# EAGLE design IO4SignalDriver-Small (EAGLE 7.7.0)

## Sheet 1 of 2
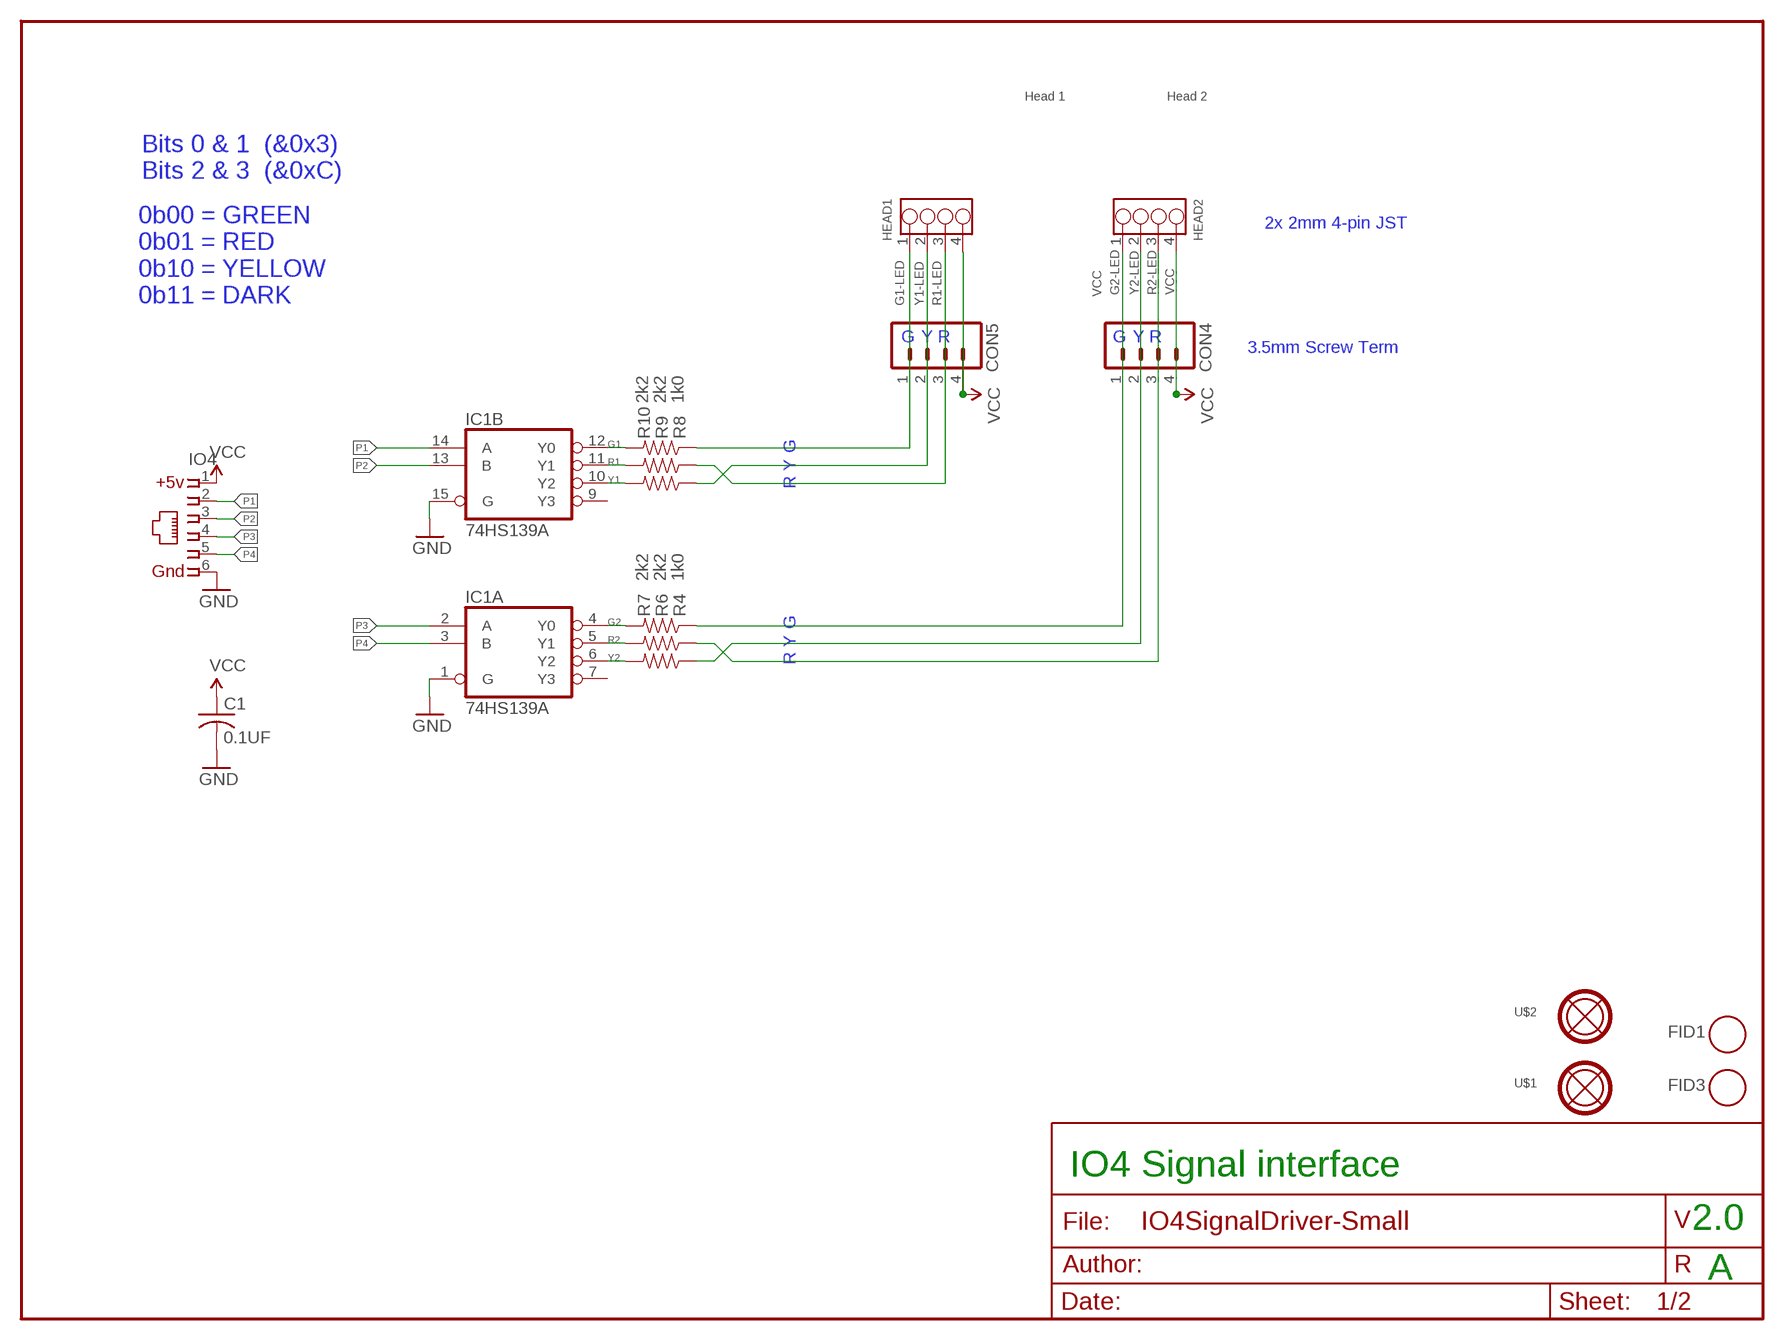
[diagram p0: schematic, sheet 1]

### Parts
C1  0.1UF  CAP0805  [0805-CAP]
CON4  CONNECTOR-M04SCREW  [SCREWTERMINAL-3.5MM-4]
CON5  CONNECTOR-M04SCREW  [SCREWTERMINAL-3.5MM-4]
FID1  FIDUCIAL  [FIDUCIAL_1MM]
FID3  FIDUCIAL  [FIDUCIAL_1MM]
HEAD1  Head 1  CONNECTOR-GROVE-4P-2.0-3470130P1  [4P-2.0]
HEAD2  Head 2  CONNECTOR-GROVE-4P-2.0-3470130P1  [4P-2.0]
IC1  74HS139A  74LS139D  [SO16]
IO4  CONNECTOR-IO4INV  [RJ25-INVERTED]
R4  1k0  R0805-RES  [0805-RES]
R6  2k2  R0805-RES  [0805-RES]
R7  2k2  R0805-RES  [0805-RES]
R8  1k0  R0805-RES  [0805-RES]
R9  2k2  R0805-RES  [0805-RES]
R10  2k2  R0805-RES  [0805-RES]
U$1  MOUNTINGHOLE  [MOUNTINGHOLE]
U$2  MOUNTINGHOLE  [MOUNTINGHOLE]

### Nets
G1: IC1.12(B:Y0) R10.2
G1-LED: CON5.1 HEAD1.1 R10.1
G2: IC1.4(A:Y0) R7.2
G2-LED: CON4.1 HEAD2.1 R7.1
GND [Power]: C1.2 IC1.1(A:G) IC1.15(B:G) IO4.6
P1 [signals]: IC1.14(B:A) IO4.2
P2 [signals]: IC1.13(B:B) IO4.3
P3 [signals]: IC1.2(A:A) IO4.4
P4 [signals]: IC1.3(A:B) IO4.5
R1: IC1.11(B:Y1) R9.2
R1-LED: CON5.3 HEAD1.3 R9.1
R2: IC1.5(A:Y1) R6.2
R2-LED: CON4.3 HEAD2.3 R6.1
VCC [Power]: C1.1 CON4.4 CON5.4 HEAD1.4 HEAD2.4 IO4.1
Y1: IC1.10(B:Y2) R8.2
Y1-LED: CON5.2 HEAD1.2 R8.1
Y2: IC1.6(A:Y2) R4.2
Y2-LED: CON4.2 HEAD2.2 R4.1
Unconnected: IC1.7(A:Y3) IC1.9(B:Y3)

### Notes on the sheet
- Bits 0 & 1  (&0x3)
  Bits 2 & 3  (&0xC)
- 2x 2mm 4-pin JST
- 0b00 = GREEN
  0b01 = RED
  0b10 = YELLOW
  0b11 = DARK
- G | Y | R | G | Y | R
- 3.5mm Screw Term
- G
- Y
- R
- G
- Y
- R
- IO4 Signal interface
- 2.0
- A

## Sheet 2 of 2
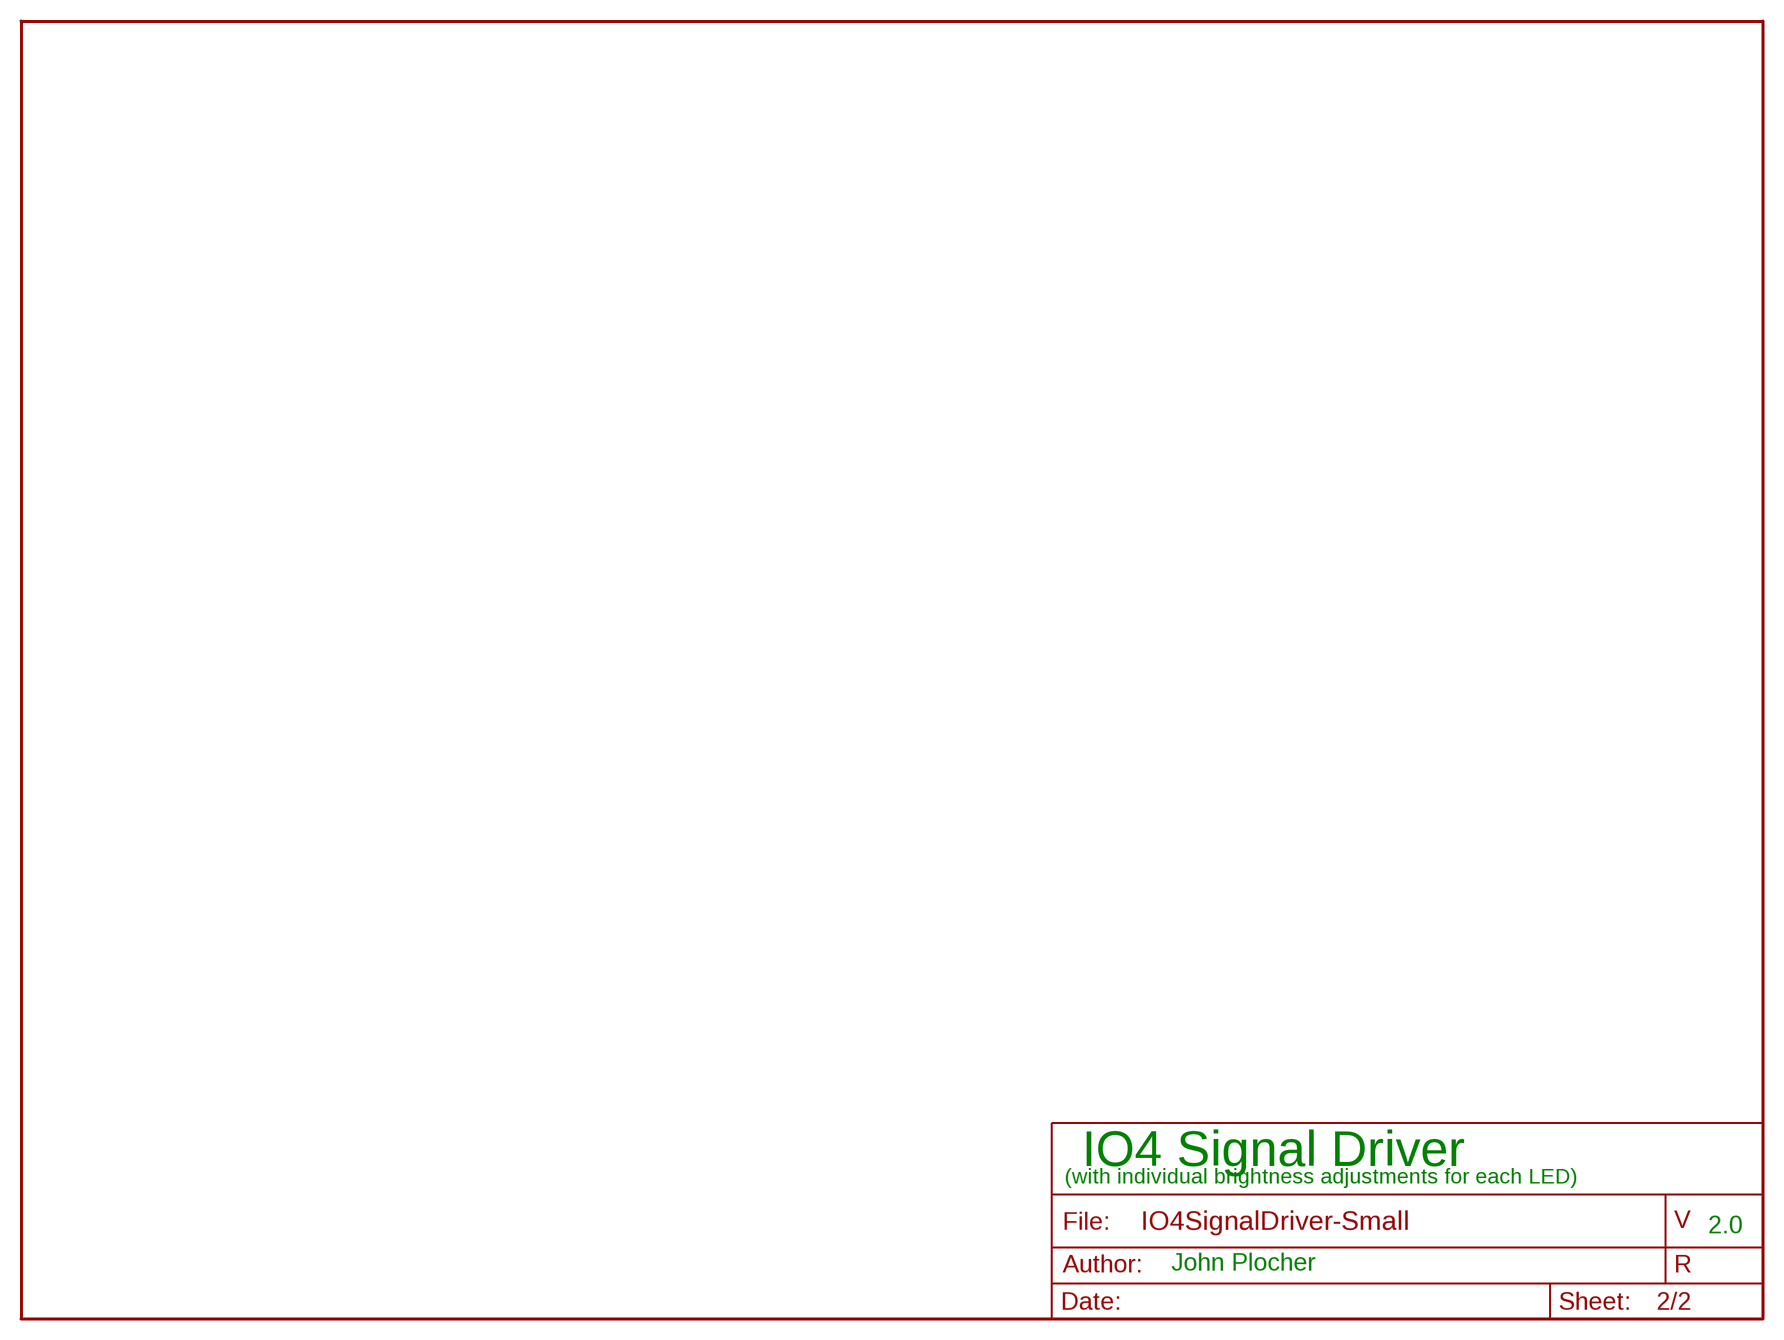
[diagram p1: schematic, sheet 2]

### Notes on the sheet
- IO4 Signal Driver
- (with individual brightness adjustments for each LED)
- 2.0
- John Plocher

## Power pins joined to a net without a drawn wire
GND: IC1.8(P:GND)
VCC: IC1.16(P:VCC)

## Library data of the parts
C1 = SPCoast:CAP*
CON4 CON5 = SPCoast:CONNECTOR-M04: Header 4 Standard 4-pin 0.1" header. Use with straight break away headers (SKU : PRT-00116), right angle break away headers (PRT-00553), swiss pins (PRT-00743), machine pins (PRT-00117), and female headers (PRT-00115). Molex polarized connector foot print use with SKU : PRT-08231 with associated crimp pins and housings. 1MM SMD Version SKU: PRT-10208
FID1 FID3 = SPCoast:FIDUCIAL: For use by pick and place machines to calibrate the vision/machine, 1mm By microbuilder.eu
HEAD1 HEAD2 = SPCoast:CONNECTOR-GROVE-4P-2.0
IC1 = SPCoast:74*139: Dual 2-line to 4-line DECODER/DEMULTIPLEXER
IO4 = SPCoast:CONNECTOR-IO4
R4 R6-R10 = SPCoast:R*: Resistor Basic schematic elements and footprints for 0603, 1206, and PTH 1/10th watt (small) resistors.
U$1 U$2 = SPCoast:MOUNTINGHOLE: Mounting hole with top and bottom copper and stop rings

## Net classes
0 default: width 0.254 mm, drill 0.5 mm
1 Power: width 0.254 mm, drill 0.6 mm
2 signals: width 0.254 mm, drill 0.5 mm

## Board
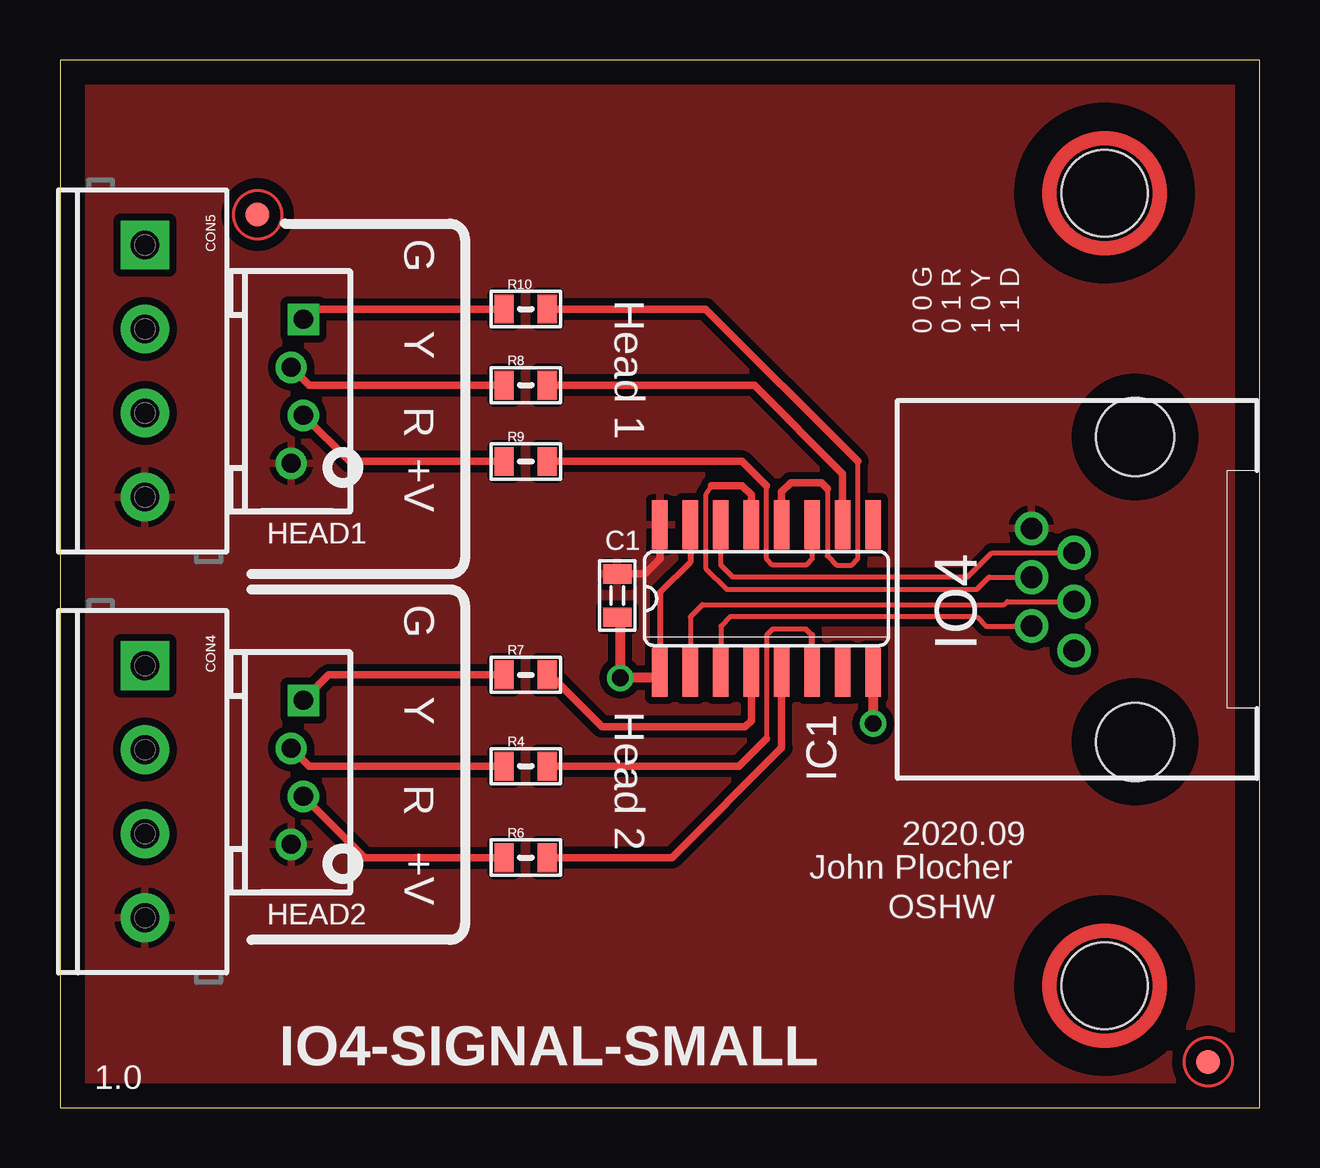
[diagram p2: board, top side]
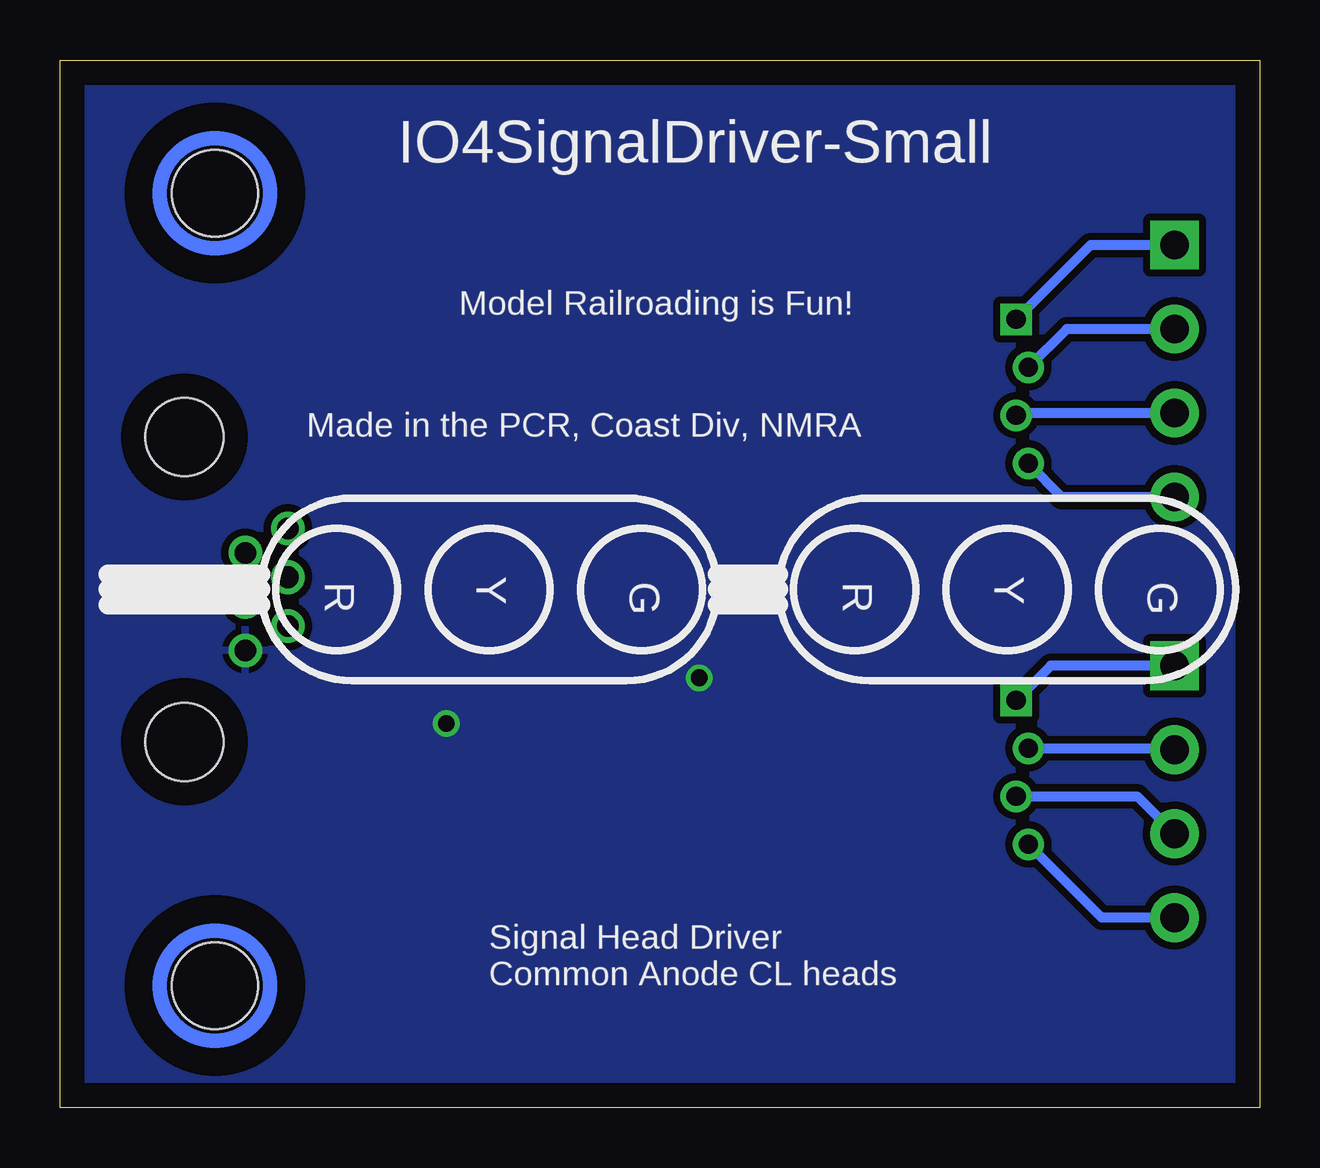
[diagram p3: board, bottom side, seen from below]

Size 50 x 43.65 mm. Coordinates in mm from the lower left corner, seen from the top.
Outline: 50,0 50,43.65 0,43.65 0,0 50,0
Copper layers (1*16): Top 0.035mm / dielectric 1.5mm / Bottom 0.035mm
Design rules "default": minimum track width 10mil, minimum drill 24mil, track to track 8mil, track to pad 8mil, pad to pad 8mil, via to via 8mil, smd to smd 8mil, copper to edge 40mil, drill to drill 8mil, minimum pad ring 10mil, minimum via ring 8mil, stop-mask expansion 4mil, vias tented up to drill 0mil, thermal gap 10mil

### Footprints (pad centres in the part's own frame; a part is rotated, then mirrored left to right if it is on the bottom)
0805-CAP = smd 0.8 x 1.2: 1 -0.9,0; 2 0.9,0
SCREWTERMINAL-3.5MM-4 = drill 1.2 pad 2.032 square: 1 0,0 | drill 1.2 pad 2.032: 2 3.5,0; 3 7,0; 4 10.5,0
FIDUCIAL_1MM = smd 1 x 1: 1 0,0
4P-2.0 = drill 0.8 pad 1.27 square: 1 -3,0.254 | drill 0.8 pad 1.27: 2 -1,-0.254; 3 1,0.254; 4 3,-0.254
SO16 = smd 0.66 x 2.032: 1 -4.445,-3.073; 2 -3.175,-3.073; 3 -1.905,-3.073; 4 -0.635,-3.073; 5 0.635,-3.073; 6 1.905,-3.073; 7 3.175,-3.073; 8 4.445,-3.073; 9 4.445,3.073; 10 3.175,3.073; 11 1.905,3.073; 12 0.635,3.073; 13 -0.635,3.073; 14 -1.905,3.073; 15 -3.175,3.073; 16 -4.445,3.073
RJ25-INVERTED = drill 0.9 pad 1.4: 1 2.54,4.318; 2 1.524,2.54; 3 0.508,4.318; 4 -0.508,2.54; 5 -1.524,4.318; 6 -2.54,2.54 | hole 3.251: -6.35,0; 6.35,0
0805-RES = smd 0.8 x 1.2: 1 -0.9,0; 2 0.9,0
MOUNTINGHOLE = hole 3.6: 0,0

### Placement (x,y rotation side)
C1  23.23,21.34 270 top
CON4  3.54,18.41 270 top
CON5  3.54,35.94 270 top
FID1  47.86,1.91 0 top
FID3  8.24,37.21 0 top
HEAD1  9.89,29.84 270 top
HEAD2  9.89,13.97 270 top
IC1  29.45,21.21 0 top
IO4  44.81,21.59 90 top
R4  19.41,14.22 0 top
R6  19.41,10.41 0 top
R7  19.41,18.03 0 top
R8  19.41,30.1 0 top
R9  19.41,26.92 0 top
R10  19.41,33.27 0 top
U$1  43.55,5.08 0 top
U$2  43.55,38.1 0 top

### Tracks (layer width: path | path; a pad name or v marks a point on that pad's centre or on a via)
G1
  Top 0.203: 31.99,25.78 31.99,22.99 32.37,22.61 33,22.61 33.26,22.86 33.26,26.92
  Top 0.305: IC1.12 30.08,25.65 30.46,26.04 31.73,26.04 31.99,25.78 | 33.26,26.92 26.91,33.27 R10.2
G1-LED
  Top 0.305: HEAD1.1 10.57,33.27 R10.1
  Bottom 0.406: CON5.1 7.05,35.94 HEAD1.1
G2
  Top 0.305: IC1.4 28.81,16.13 28.56,15.88 22.59,15.88 20.43,18.03 R7.2
G2-LED
  Top 0.305: HEAD2.1 11.21,18.03 R7.1
  Bottom 0.406: CON4.1 8.7,18.41 HEAD2.1
GND  (via drill 0.7)
  Top 0.254: IC1.15 26.27,22.73 25,21.46 IC1.1 | C1.2
  Top 0.406: C1.2 23.35,20.33 v23.35,17.91 24.77,17.91 IC1.1 | IC1.8 v33.89,16
  pour Bottom (isolate 0.305): 0,0 0,43.56 49.9,43.56 49.9,0
P1
  Top 0.203: IC1.14 27.54,22.61 28.05,22.1 37.83,22.1 38.85,23.11 IO4.2
P2
  Top 0.203: 27.16,25.91 26.91,25.53 26.91,22.48 27.8,21.59 38.21,21.59 38.72,22.1 IO4.3
  Top 0.305: IC1.13 28.81,25.53 28.43,25.91 27.16,25.91
P3
  Top 0.203: IC1.2 26.27,20.45 26.78,20.95 39.35,20.95 39.48,21.08 IO4.4
P4
  Top 0.203: IC1.3 27.54,20.07 27.92,20.45 38.21,20.45 38.59,20.07 IO4.5
R1
  Top 0.203: IC1.11 31.35,22.86 31.1,22.61 29.7,22.61 29.45,22.86 29.45,25.91
  Top 0.305: 29.45,25.91 28.43,26.92 R9.2
R1-LED
  Top 0.305: HEAD1.3 12.06,26.92 R9.1
  Bottom 0.406: CON5.3 10.05,28.94 HEAD1.3
R2
  Top 0.305: IC1.5 30.08,14.99 25.51,10.41 R6.2
R2-LED
  Top 0.305: HEAD2.3 12.7,10.41 R6.1
  Bottom 0.406: HEAD2.3 5.09,12.97 CON4.3
VCC
  Top 0.305: IC1.16 25,22.86 24.38,22.24 C1.1 23.21,22.23
  Bottom 0.406: CON5.4 8.23,25.44 HEAD1.4 | CON4.4 6.58,7.92 HEAD2.4
  pour Top (isolate 0.305): 0,0 0,43.56 49.9,43.56 49.9,0
Y1
  Top 0.305: IC1.10 32.62,26.42 28.94,30.1 R8.2
Y1-LED
  Top 0.305: HEAD1.2 10.38,30.1 R8.1
  Bottom 0.406: CON5.2 8.04,32.44 HEAD1.2
Y2
  Top 0.203: 31.35,19.68 31.1,19.94 29.7,19.94 29.45,19.68 29.45,15.37
  Top 0.254: IC1.6 31.35,19.68
  Top 0.305: 29.45,15.37 28.3,14.22 R4.2
Y2-LED
  Top 0.305: HEAD2.2 10.38,14.22 R4.1
  Bottom 0.406: HEAD2.2 3.6,14.97 CON4.2

### Text on the board
tPlace: G | Head 1 | Y | 0 0 G / 0 1 R / 1 0 Y / 1 1 D | R | +V | G | Y | Head 2 | R | 2020.09 | +V | John Plocher | OSHW | IO4-SIGNAL-SMALL | 1.0
bPlace: Model Railroading is Fun! | Made in the PCR, Coast Div, NMRA | G | Y | R | G | Y | R | Signal Head Driver / Common Anode CL heads
Document: White Silkscreen
_tNames: CON5 | R10 | R8 | R9 | HEAD1 | C1 | CON4 | R7 | IO4 | R4 | IC1 | R6 | HEAD2